# EAGLE design hs-256-expansion-uphone (EAGLE 8.3.2)
DESIGNER: Jonathan P. Newman; DESIGN_NAME: headstage-256 Expansion Boards; LICENSE: CERN OHL v1.2; REVISION: 1.0
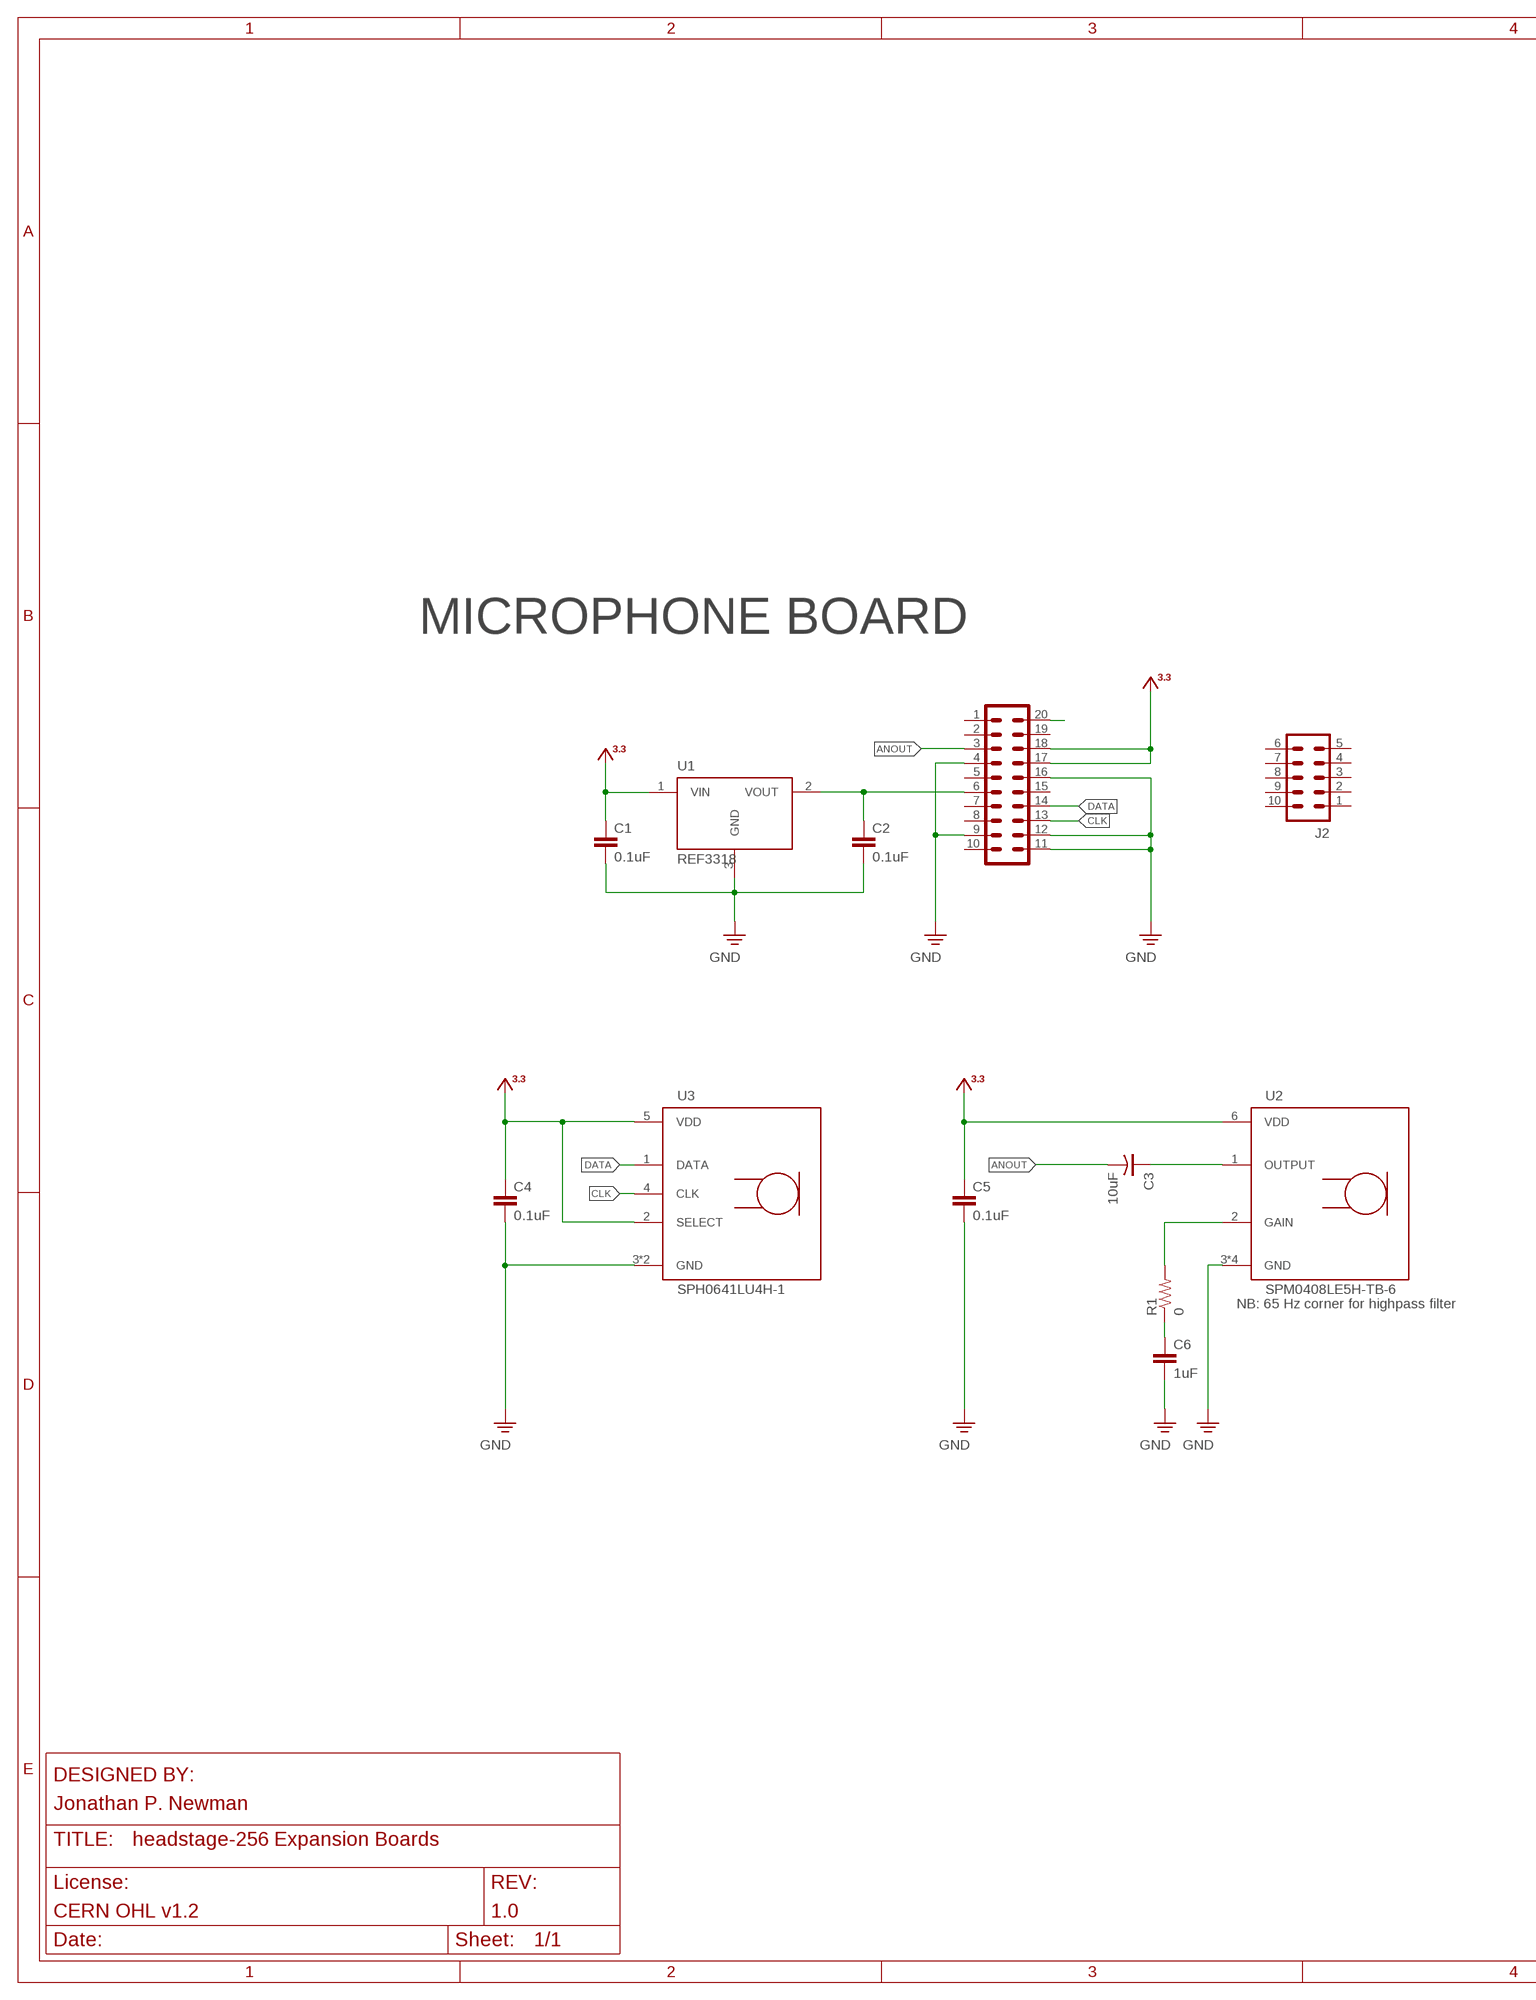
[diagram p0: schematic, sheet 1, part 1 of 2]
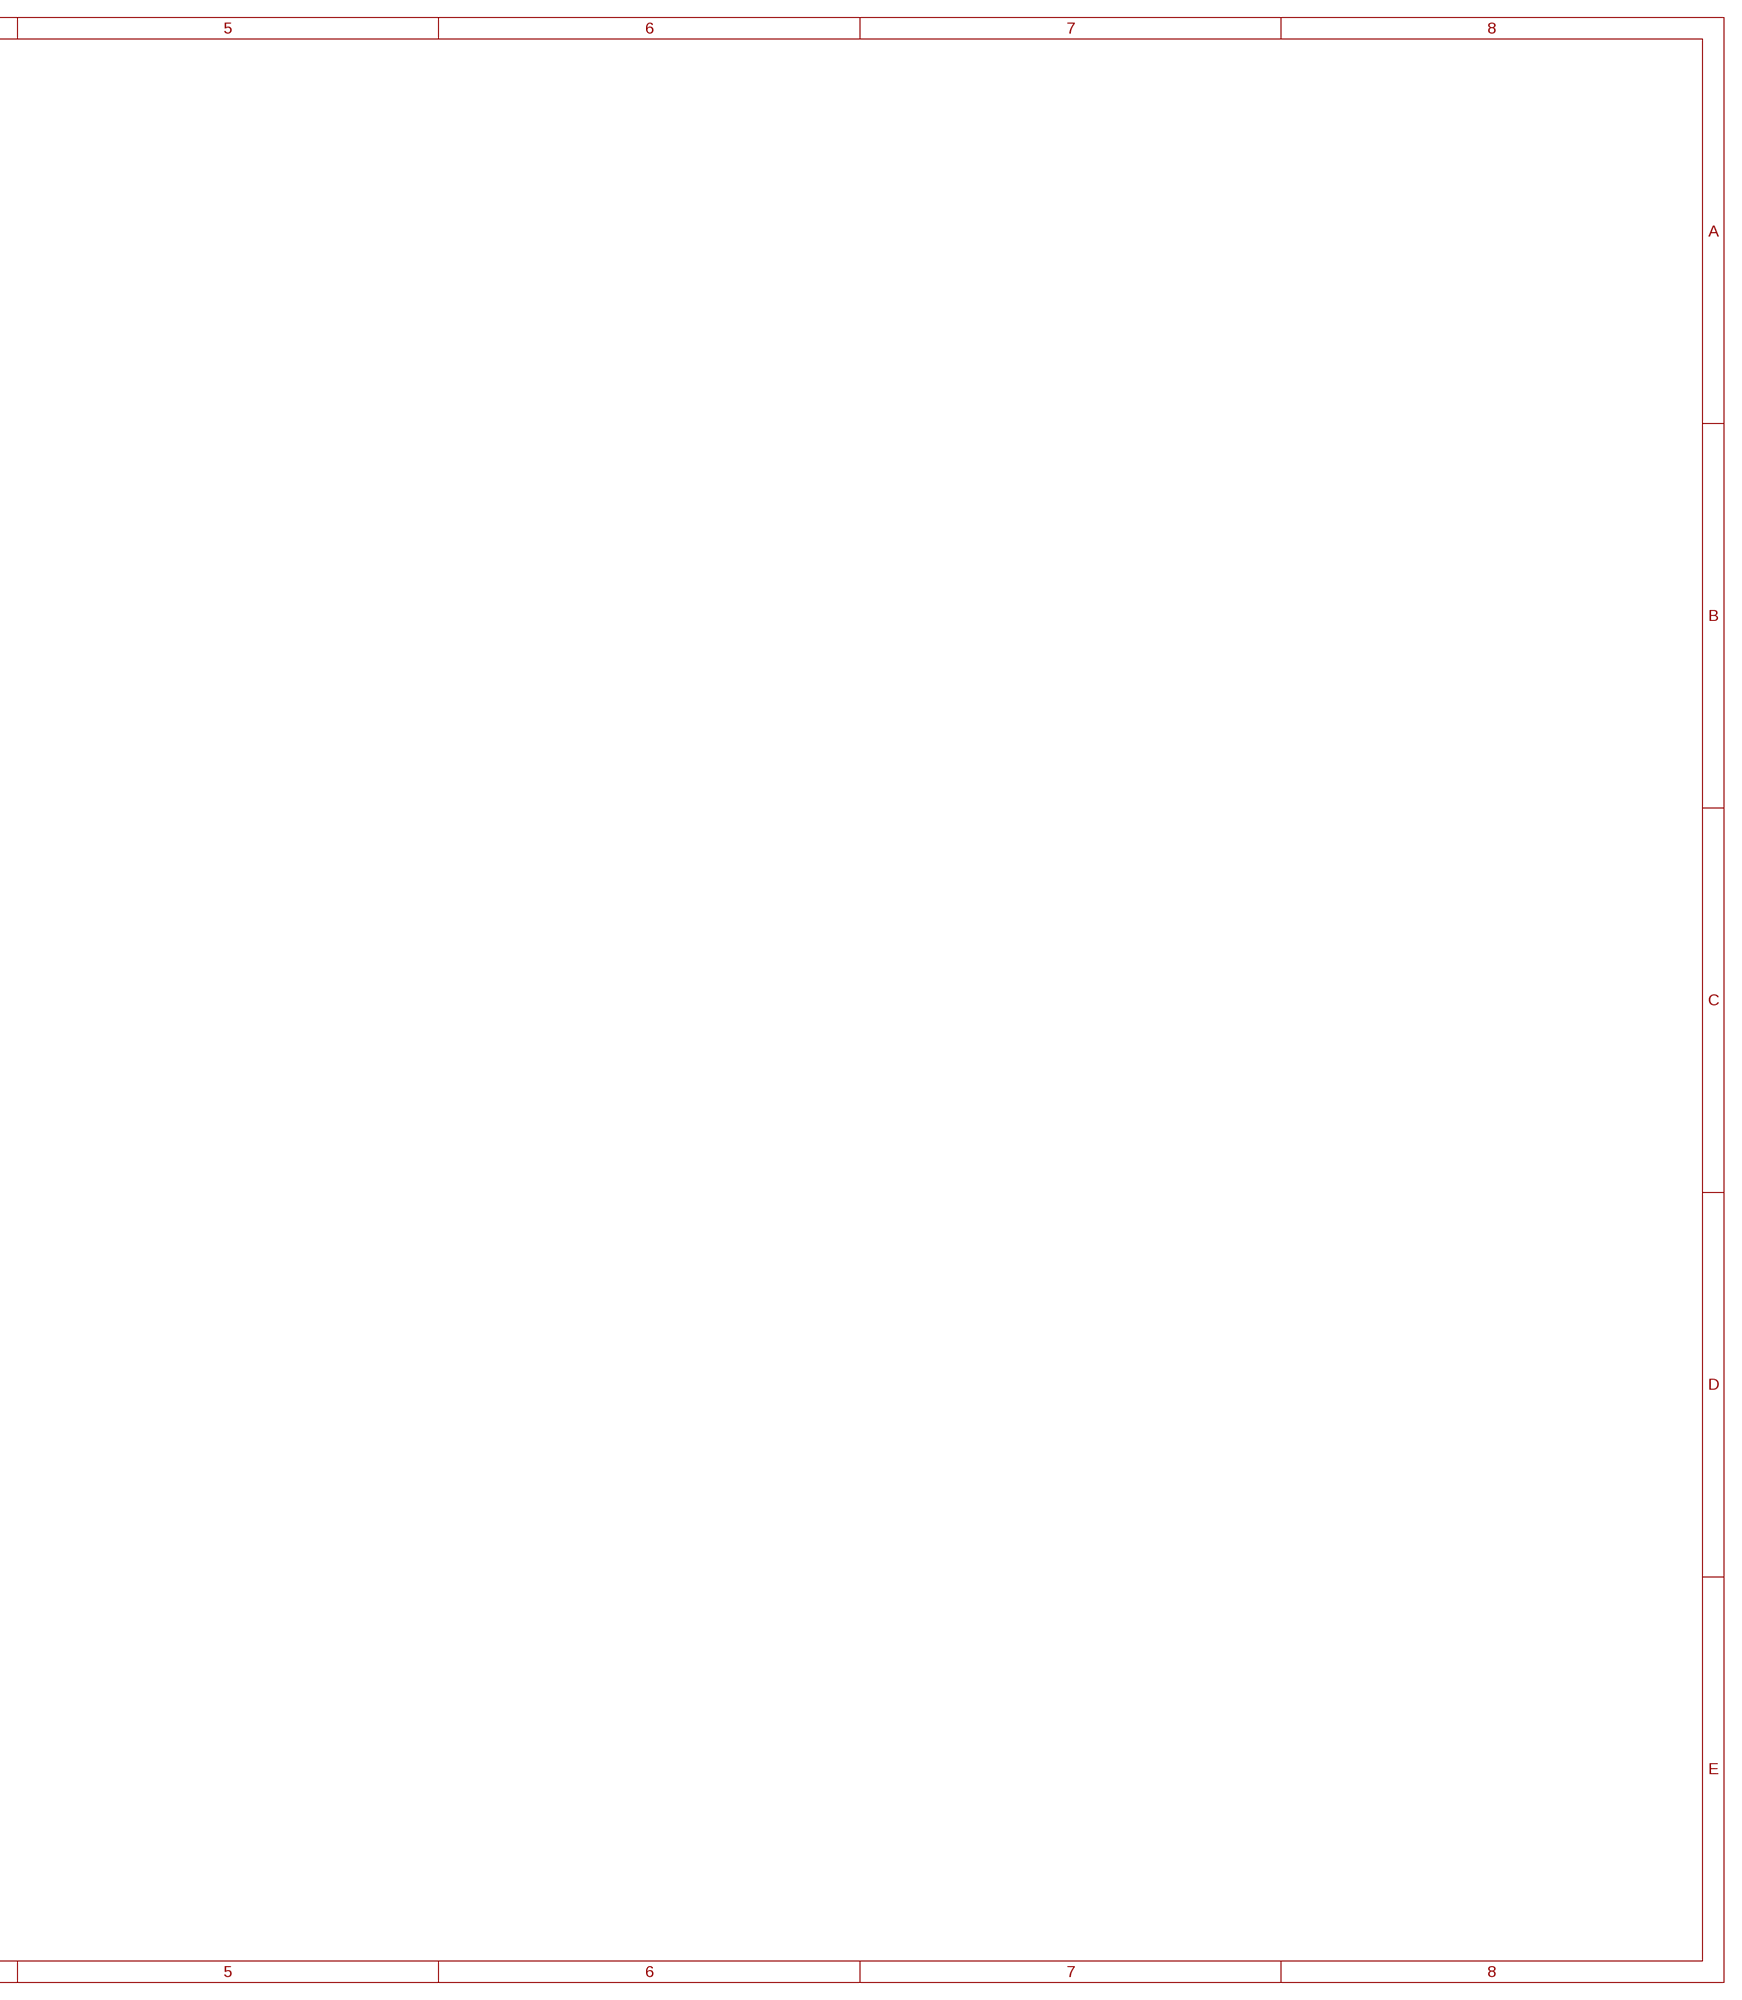
[diagram p1: schematic, sheet 1, part 2 of 2]

## Parts
C1  0.1uF  C_0402  [0402]
C2  0.1uF  C_0402  [0402]
C3  10uF  C-POL_0805  [0805-POL]
C4  0.1uF  C_0402  [0402]
C5  0.1uF  C_0402  [0402]
C6  1uF  C_0402  [0402]
J1  PINHD-2X10_DF40-20REC  [DF40-20REC]
J2  PINHD-2X5_DF40-REC  [DF40-10REC]
R1  0  R_0402  [0402]
U1  REF3318  VREF_SOT  [SOT23]
U2  SPM0408LE5H-TB-6  MICROPHONE-AN_SPM  [KNOWLES-SPM]
U3  SPH0641LU4H-1  MICROPHONE-PCM_SPH  [KNOWLES-SPH]

## Nets
+3V3: C1.1 C4.1 C5.1 J1.17 J1.18 U1.1(VIN) U2.6(VDD) U3.2(SELECT) U3.5(VDD)
ANOUT: C3.C(-) J1.3
CLK: J1.13 U3.4(CLK)
DATA: J1.14 U3.1(DATA)
GND: C1.2 C2.2 C4.2 C5.2 C6.2 J1.4 J1.9 J1.11 J1.12 J1.16 U1.3(GND) U2.3(GND) U2.4(GND) U2.5(GND) U2.7(GND) U3.3(GND) U3.6(GND)
N$1: C6.1 R1.1
N$2: J1.20
N$3: R1.2 U2.2(GAIN)
N$5: C3.A(+) U2.1(OUTPUT)
VREF: C2.1 J1.6 U1.2(VOUT)
Unconnected: J1.1 J1.2 J1.5 J1.7 J1.8 J1.10 J1.15 J1.19 J2.1 J2.2 J2.3 J2.4 J2.5 J2.6 J2.7 J2.8 J2.9 J2.10

## Notes on the sheet
- MICROPHONE BOARD
- NB: 65 Hz corner for highpass filter

## Library data of the parts
C1 C2 C4-C6 = jonnew:C: Capacitor
C3 = jonnew:C-POL: Polarized Capacitor
J1 = jonnew:PINHD-2X10
J2 = jonnew:PINHD-2X5
R1 = jonnew:R: Resistor
U1 = jonnew:VREF
U2 = jonnew:MICROPHONE-AN
U3 = jonnew:MICROPHONE-PCM

## Board
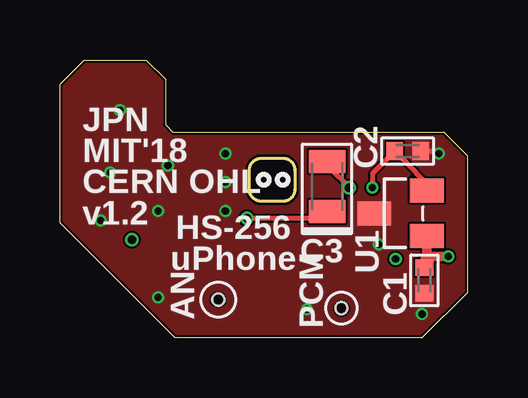
[diagram p2: board, top side]
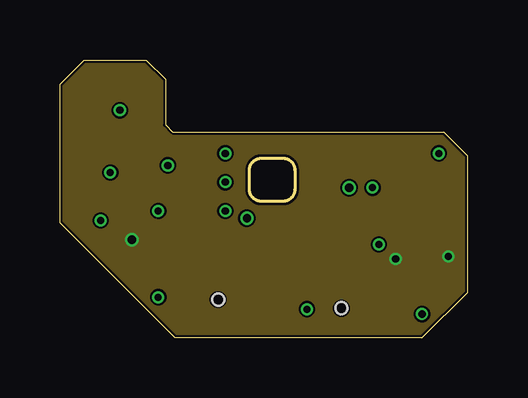
[diagram p3: board, inner layer Route2]
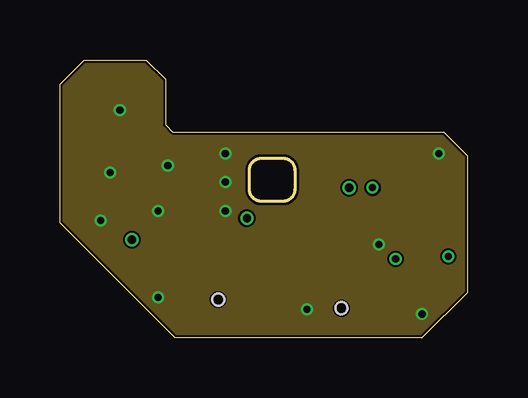
[diagram p4: board, inner layer Route15]
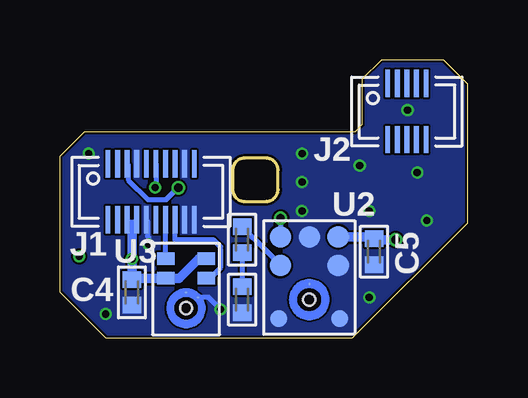
[diagram p5: board, bottom side, seen from below]

Size 17 x 11.6 mm. Coordinates in mm from the lower left corner, seen from the top.
Outline: 0,4.8 0,10.6 1,11.6 3.6,11.6 4.4,10.8 4.4,8.9 4.7,8.6 16,8.6 17,7.6 17,1.9 15.1,0 4.8,0 0,4.8
Copper layers (1+2*15+16): Top 0.035mm / dielectric 0.2mm / Route2 0.0175mm / dielectric 1.065mm / Route15 0.0175mm / dielectric 0.2mm / Bottom 0.035mm
Design rules "jlcpcb-4-layer_JLC7628-stackup": minimum track width 3.5mil, minimum drill 0.2mm, track to track 3.5mil, track to pad 5mil, pad to pad 5mil, via to via 5mil, smd to smd 0mil, copper to edge 0.1mm, drill to drill 5mil, minimum pad ring 4mil, minimum via ring 4mil, stop-mask expansion 3mil, vias tented up to drill 100mil, thermal gap 10mil

### Footprints (pad centres in the part's own frame; a part is rotated, then mirrored left to right if it is on the bottom)
0402 = smd 0.686 x 0.762: 1 -0.533,0; 2 0.533,0
0805-POL = smd 0.965 x 1.524: A -1.041,0; C 1.041,0
DF40-20REC = smd 0.2 x 1.14: 1 -1.8,1.17; 2 -1.4,1.17; 3 -1,1.17; 4 -0.6,1.17; 5 -0.2,1.17; 6 0.2,1.17; 7 0.6,1.17; 8 1,1.17; 9 1.4,1.17; 10 1.8,1.17; 11 1.8,-1.17; 12 1.4,-1.17; 13 1,-1.17; 14 0.6,-1.17; 15 0.2,-1.17; 16 -0.2,-1.17; 17 -0.6,-1.17; 18 -1,-1.17; 19 -1.4,-1.17; 20 -1.8,-1.17
DF40-10REC = smd 0.2 x 1.14: 1 -0.8,1.17; 2 -0.4,1.17; 3 0,1.17; 4 0.4,1.17; 5 0.8,1.17; 6 0.8,-1.17; 7 0.4,-1.17; 8 0,-1.17; 9 -0.4,-1.17; 10 -0.8,-1.17
SOT23 = smd 1 x 1.4: 1 -0.95,-1.1; 2 0.95,-1.1; 3 0,1.1
KNOWLES-SPM = smd 0.9 x 0.9: 1 -1.204,2.616; 2 -1.204,1.422; 5 1.204,1.422; 6 1.204,2.616; 7 0,2.616 | smd 0.7 x 0.7: 3 -1.265,-0.79; 4 1.265,-0.79 | smd 0.1 x 0.1: 8 0,0.66 | hole 0.5: 0,0
KNOWLES-SPH = smd 0.725 x 0.522: 1 -0.838,2.074; 2 -0.838,1.252; 4 0.838,1.252; 5 0.838,2.074 | smd 0.1 x 0.1: 3 0,0.66; 6 0.5,0.46 | hole 0.5: 0,0

### Placement (x,y rotation side)
C1  15.2,2.4 270 top
C2  14.5,7.8 0 top
C3  11.14,6.32 90 top
C4  14,1.9 270 bottom
C5  3.9,3.6 270 bottom
C6  9.4,1.6 270 bottom
J1  13.2,6.1 0 bottom
J2  2.53,9.45 0 bottom
R1  9.4,4.1 90 bottom
U1  14.2,5.2 90 top
U2  6.6,1.6 0 bottom
U3  11.74,1.24 0 bottom

### Tracks (layer width: path | path; a pad name or v marks a point on that pad's centre or on a via)
+3V3  (via drill 0.3, 0.35)
  Top 0.4: v16.2,3.4 15.27,3.4 C1.1 15.3,3.03 U1.1
  Bottom 0.2: J1.17 14,4.73 J1.18
  Bottom 0.4: U2.6 3.98,4.22 C5.1 3.87,4.1 v3,4.1 | 14,4.73 v14,3.3 C4.1 13.94,2.49 U3.2 12.02,2.49 11.2,3.31 U3.5
  pour Route2 (no thermals): -13.8,27.1 45,27.2 45,-22.8 -13.8,-22.9
ANOUT  (via drill 0.35)
  Top 0.2: v12.06,6.27 11.26,7.08 arc-45 C3.C
  Bottom 0.2: J1.3 14.15,7.22 14.15,6.59 13.32,5.77 12.57,5.77 v12.06,6.27
CLK
  Bottom 0.2: J1.13 12.2,4.1 10.6,4.1 10.3,3.8 10.3,3.69 10.29,3.68 10.29,2.95 10.74,2.49
  Bottom 0.4: U3.4 10.74,2.49
DATA
  Bottom 0.2: U3.1 12.6,3.34 J1.14
GND  (via drill 0.3)
  Top 0.2: C2.2 15.7,7.8 v15.8,7.7
  Bottom 0.2: 11.7,1.94 U3.3 11.44,1.9 U3.6 | J1.16 13.35,4.88 13.35,4.25 13.3,4.2 v13.3,3.9 | v10.3,1.2 10.8,1.7 11.14,1.7
  other vias: 6.9,6.5 4.1,1.7 15.1,1 6.9,7.7 6.9,5.3 2.1,6.9 2.5,9.5 4.5,7.2 1.7,4.9 4.1,5.3
  pour Route15 (no thermals): -14.8,28.1 46,28.2 46.5,-23.8 -14.8,-23.9
  pour Bottom (no thermals): -12.8,26.1 44,26.2 44,-21.8 -12.8,-21.9
  pour Top (no thermals): -11.8,25.1 43,25.2 43,-20.8 -11.8,-20.9
N$1
  Bottom 0.2: R1.1 C6.1
N$3
  Bottom 0.2: U2.2 7.8,3.05 8.91,4.16 8.93,4.16 R1.2
N$5  (via drill 0.35)
  Top 0.2: v7.8,5 10.74,5 C3.A
  Bottom 0.2: v7.8,5 U2.1
VREF  (via drill 0.3)
  Top 0.2: 13.04,6.34 v13.04,6.27 13.04,6.87 C2.1 14.44,7.33 14.44,7.31 15.3,6.45 U1.2
  Bottom 0.2: J1.6 13,6.31 v13.04,6.27

### Text on the board
tPlace: JPN / MIT'18 / CERN OHL / v1.2 | HS-256 / uPhone | AN | PCM